# EAGLE schematic Ffrydiau_core (EAGLE 9.6.2)
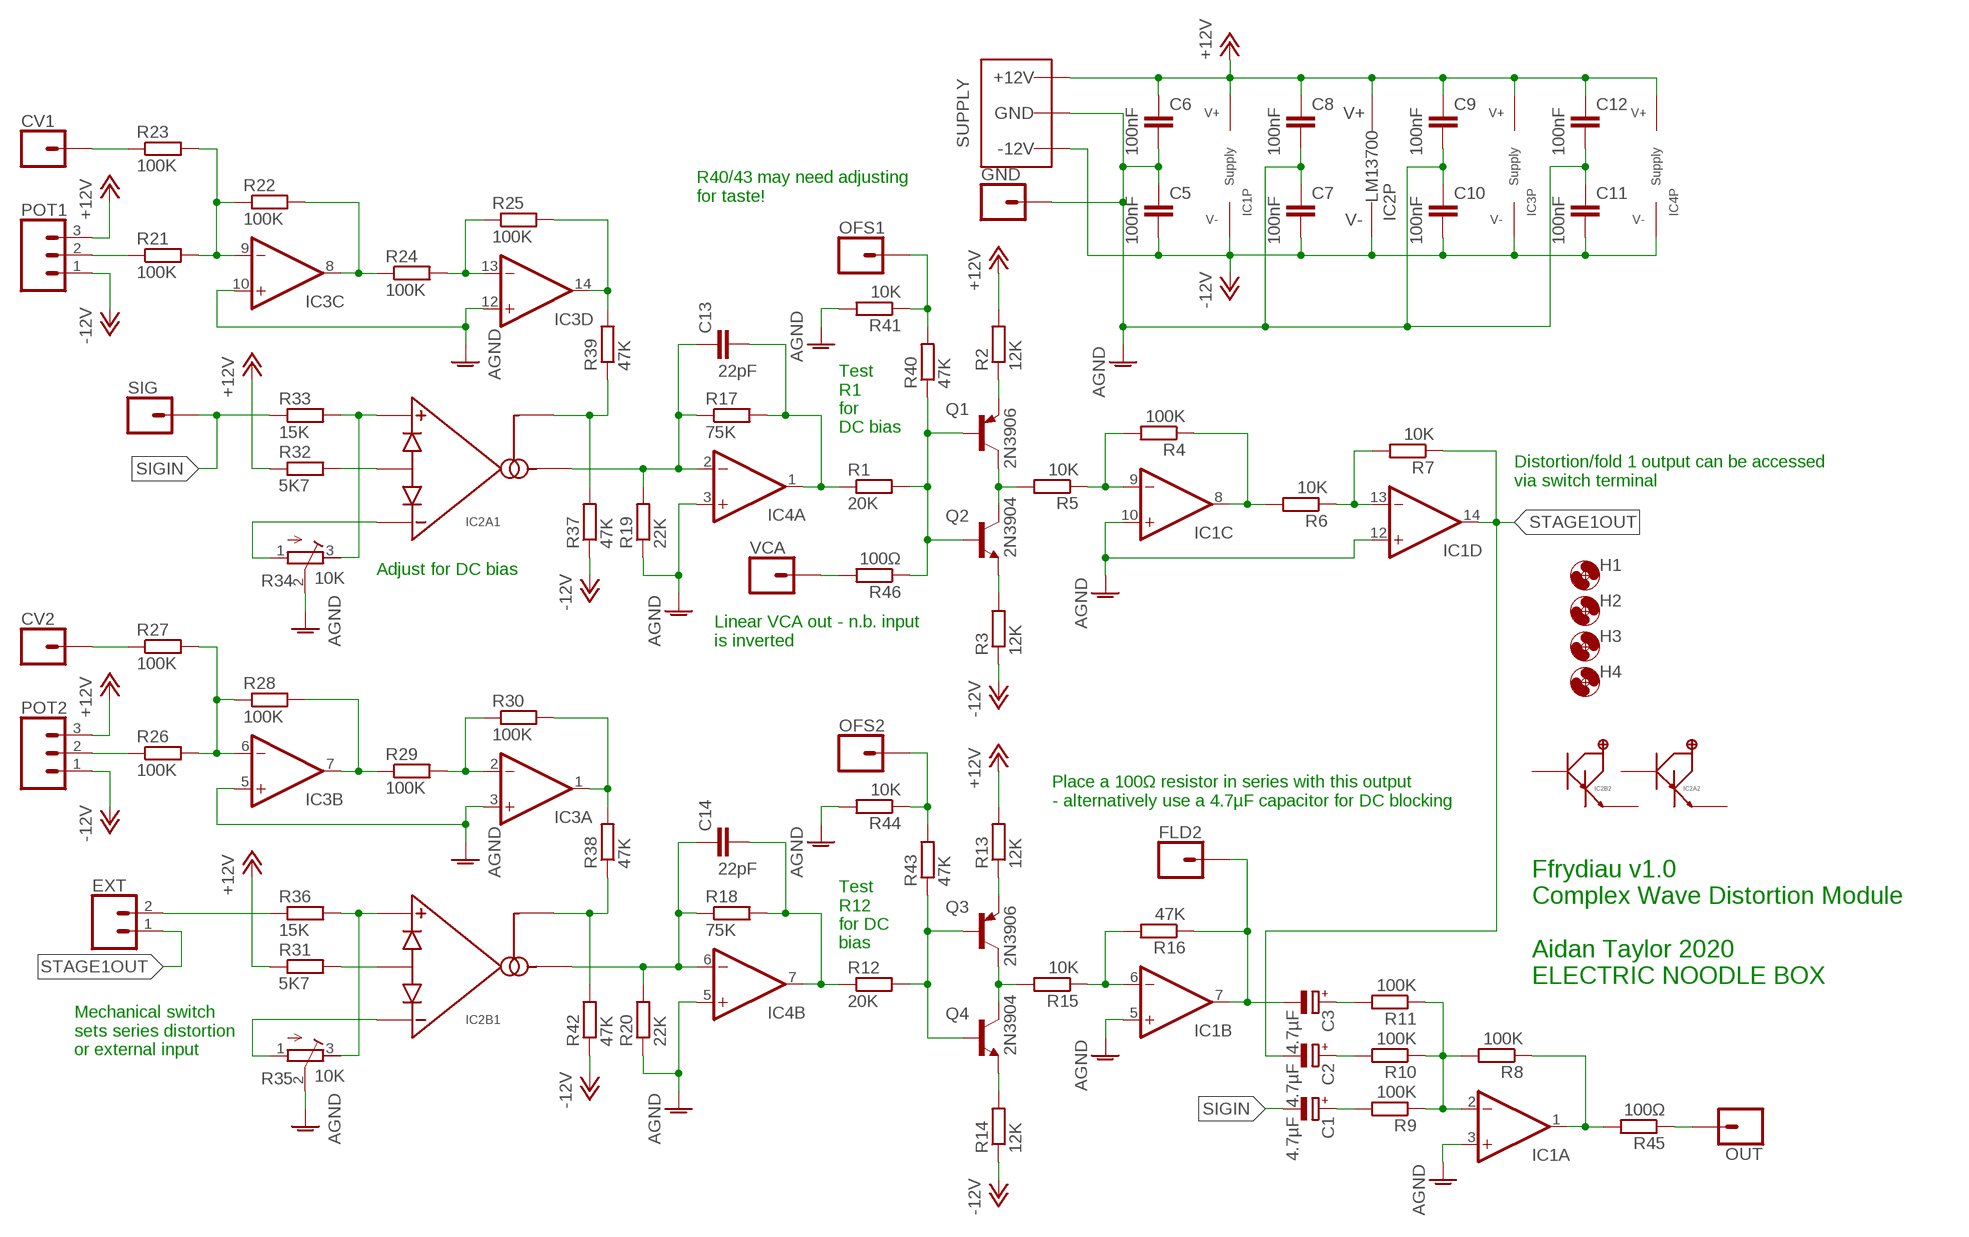
[diagram p0: schematic, sheet 1]

## Parts
C1  4.7µF  CPOL-EUE2,5-6E  [E2,5-6E]
C2  4.7µF  CPOL-EUE2,5-6E  [E2,5-6E]
C3  4.7µF  CPOL-EUE2,5-6E  [E2,5-6E]
C5  100nF  C-EU050-025X075  [C050-025X075]
C6  100nF  C-EU050-025X075  [C050-025X075]
C7  100nF  C-EU050-025X075  [C050-025X075]
C8  100nF  C-EU050-025X075  [C050-025X075]
C9  100nF  C-EU050-025X075  [C050-025X075]
C10  100nF  C-EU050-025X075  [C050-025X075]
C11  100nF  C-EU050-025X075  [C050-025X075]
C12  100nF  C-EU050-025X075  [C050-025X075]
C13  22pF  C-EU050-025X075  [C050-025X075]
C14  22pF  C-EU050-025X075  [C050-025X075]
CV1  1XWIREPAD  [1X01]
CV2  1XWIREPAD  [1X01]
EXT  2XWIREPAD  [1X02]
FLD2  1XWIREPAD  [1X01]
GND  1XWIREPAD  [1X01]
H1  MOUNT-HOLE3.2  [3,2]
H2  MOUNT-HOLE3.2  [3,2]
H3  MOUNT-HOLE3.2  [3,2]
H4  MOUNT-HOLE3.2  [3,2]
IC1  TL0X4DIL  [DIL14]
IC2  LM13700DIL  [DIL16]
IC3  TL0X4DIL  [DIL14]
IC4  TL0X2DIL  [DIL08]
OFS1  1XWIREPAD  [1X01]
OFS2  1XWIREPAD  [1X01]
OUT  1XWIREPAD  [1X01]
POT1  3XWIREPAD  [1X03]
POT2  3XWIREPAD  [1X03]
Q1  2N3906  [TO92]
Q2  2N3904  [TO92]
Q3  2N3906  [TO92]
Q4  2N3904  [TO92]
R1  20K  R-EU_0207/10  [0207/10]
R2  12K  R-EU_0207/10  [0207/10]
R3  12K  R-EU_0207/10  [0207/10]
R4  100K  R-EU_0207/10  [0207/10]
R5  10K  R-EU_0207/10  [0207/10]
R6  10K  R-EU_0207/10  [0207/10]
R7  10K  R-EU_0207/10  [0207/10]
R8  100K  R-EU_0207/10  [0207/10]
R9  100K  R-EU_0207/10  [0207/10]
R10  100K  R-EU_0207/10  [0207/10]
R11  100K  R-EU_0207/10  [0207/10]
R12  20K  R-EU_0207/10  [0207/10]
R13  12K  R-EU_0207/10  [0207/10]
R14  12K  R-EU_0207/10  [0207/10]
R15  10K  R-EU_0207/10  [0207/10]
R16  47K  R-EU_0207/10  [0207/10]
R17  75K  R-EU_0207/10  [0207/10]
R18  75K  R-EU_0207/10  [0207/10]
R19  22K  R-EU_0207/10  [0207/10]
R20  22K  R-EU_0207/10  [0207/10]
R21  100K  R-EU_0207/10  [0207/10]
R22  100K  R-EU_0207/10  [0207/10]
R23  100K  R-EU_0207/10  [0207/10]
R24  100K  R-EU_0207/10  [0207/10]
R25  100K  R-EU_0207/10  [0207/10]
R26  100K  R-EU_0207/10  [0207/10]
R27  100K  R-EU_0207/10  [0207/10]
R28  100K  R-EU_0207/10  [0207/10]
R29  100K  R-EU_0207/10  [0207/10]
R30  100K  R-EU_0207/10  [0207/10]
R31  5K7  R-EU_0207/10  [0207/10]
R32  5K7  R-EU_0207/10  [0207/10]
R33  15K  R-EU_0207/10  [0207/10]
R34  10K  R-TRIMM3296W  [RTRIM3296W]
R35  10K  R-TRIMM3296W  [RTRIM3296W]
R36  15K  R-EU_0207/10  [0207/10]
R37  47K  R-EU_0207/10  [0207/10]
R38  47K  R-EU_0207/10  [0207/10]
R39  47K  R-EU_0207/10  [0207/10]
R40  47K  R-EU_0207/10  [0207/10]
R41  10K  R-EU_0207/10  [0207/10]
R42  47K  R-EU_0207/10  [0207/10]
R43  47K  R-EU_0207/10  [0207/10]
R44  10K  R-EU_0207/10  [0207/10]
R45  100Ω  R-EU_0207/10  [0207/10]
R46  100Ω  R-EU_0207/10  [0207/10]
SIG  1XWIREPAD  [1X01]
VCA  1XWIREPAD  [1X01]
WP1  COMBO_SUPPLY_HEADER  [COMBINED_POWER]

## Nets
+12V: C6.1 C8.1 C9.1 C12.1 IC1.4(P:V+) IC2.11(P:V+) IC3.4(P:V+) IC4.8(P:V+) POT1.3 POT2.3 R2.2 R13.2 R31.1 R32.1 WP1.V+1(V++) WP1.V+2(V++) WP1.V+3(V++)
-12V: C5.2 C7.2 C10.2 C11.2 IC1.11(P:V-) IC2.6(P:V-) IC3.11(P:V-) IC4.4(P:V-) POT1.1 POT2.1 R3.1 R14.1 R37.1 R42.1 WP1.V-1(V--) WP1.V-2(V--) WP1.V-3(V--)
AGND: C5.1 C6.2 C7.1 C8.2 C9.2 C10.1 C11.1 C12.2 GND.1 IC1.3(A:+IN) IC1.5(B:+IN) IC1.10(C:+IN) IC1.12(D:+IN) IC3.3(A:+IN) IC3.5(B:+IN) IC3.10(C:+IN) IC3.12(D:+IN) IC4.3(A:+IN) IC4.5(B:+IN) R19.1 R20.1 R34.2(S) R35.2(S) R41.2 R44.2 WP1.GND1(AGND) WP1.GND2(AGND) WP1.GND3(AGND) WP1.GND4(AGND) WP1.GND5(AGND) WP1.GND6(AGND) WP1.GND7(AGND) WP1.GND8(AGND)
N$1: Q1.2(B) Q2.2(B) R1.2 R40.1 R46.1
N$2: Q1.3(E) R2.1
N$3: Q2.3(E) R3.2
N$4: Q1.1(C) Q2.1(C) R5.2
N$5: IC1.9(C:-IN) R4.2 R5.1
N$6: IC1.8(C:OUT) R4.1 R6.2
N$7: IC1.13(D:-IN) R6.1 R7.2
N$8: OUT.1 R45.1
N$9: C13.2 IC4.1(A:OUT) R1.1 R17.2
N$10: C3.+ R11.2
N$11: C2.+ R10.2
N$12: C1.+ R9.2
N$13: IC1.2(A:-IN) R8.2 R9.1 R10.1 R11.1
N$14: IC1.1(A:OUT) R8.1 R45.2
N$15: Q3.2(B) Q4.2(B) R12.2 R43.1
N$16: Q3.3(E) R13.1
N$17: Q4.3(E) R14.2
N$18: Q3.1(C) Q4.1(C) R15.2
N$19: IC1.6(B:-IN) R15.1 R16.2
N$20: C3.- FLD2.1 IC1.7(B:OUT) R16.1
N$21: C14.1 IC2.12(B1:AMPOUT) IC4.6(B:-IN) R18.1 R20.2
N$22: C13.1 IC2.5(A1:AMPOUT) IC4.2(A:-IN) R17.1 R19.2
N$23: C14.2 IC4.7(B:OUT) R12.1 R18.2
N$24: IC3.9(C:-IN) R21.2 R22.1 R23.2
N$25: IC3.8(C:OUT) R22.2 R24.1
N$26: IC3.13(D:-IN) R24.2 R25.1
N$27: IC3.14(D:OUT) R25.2 R39.2
N$28: CV2.1 R27.1
N$29: IC3.1(A:OUT) R30.2 R38.2
N$30: POT1.2 R21.1
N$31: IC3.2(A:-IN) R29.2 R30.1
N$32: CV1.1 R23.1
N$33: IC3.7(B:OUT) R28.2 R29.1
N$34: IC3.6(B:-IN) R26.2 R27.2 R28.1
N$35: IC2.14(B1:AMP+) R35.3(E) R36.2
N$36: IC2.13(B1:AMP-) R35.1(A)
N$37: IC2.15(B1:DIODES) R31.2
N$38: IC2.2(A1:DIODES) R32.2
N$39: IC2.1(A1:AMPBIAS) R37.2 R39.1
N$40: POT2.2 R26.1
N$41: IC2.3(A1:AMP+) R33.2 R34.3(E)
N$42: IC2.4(A1:AMP-) R34.1(A)
N$43: IC2.16(B1:AMPBIAS) R38.1 R42.2
N$44: OFS1.1 R40.2 R41.1
N$45: OFS2.1 R43.2 R44.1
N$46: R46.2 VCA.1
N$47: EXT.2 R36.1
SIGIN: C1.- R33.1 SIG.1
STAGE1OUT: C2.- EXT.1 IC1.14(D:OUT) R7.1
Unconnected: IC2.7(A2:BUFF_IN) IC2.8(A2:BUFF_OUT) IC2.9(B2:BUFF_OUT) IC2.10(B2:BUFF_IN)

## Notes on the sheet
- R40/43 may need adjusting 
  for taste!
- Test
  R1
  for
  DC bias
- Distortion/fold 1 output can be accessed
  via switch terminal
- Adjust for DC bias
- Linear VCA out - n.b. input
  is inverted
- Place a 100Ω resistor in series with this output
  - alternatively use a 4.7µF capacitor for DC blocking
- Test
  R12
  for DC
  bias
- Ffrydiau v1.0
  Complex Wave Distortion Module
  
  Aidan Taylor 2020 
  ELECTRIC NOODLE BOX
- Mechanical switch
  sets series distortion
  or external input

## Library data of the parts
C1-C3 = rcl:CPOL-EU: POLARIZED CAPACITOR, European symbol; SPICEPREFIX: C
C5-C14 = rcl:C-EU: CAPACITOR, European symbol; SPICEPREFIX: C
CV1 CV2 FLD2 GND OFS1 OFS2 OUT SIG VCA = ElectricNoodleBox:1XWIREPAD
EXT = ElectricNoodleBox:2XWIREPAD
H1-H4 = holes:MOUNT-HOLE: MOUNTING HOLE with drill center marker
IC1 IC3 = ElectricNoodleBox:TL0X4: Quad Operational Amplifier; CATALOGUE: 3005140; RETAILER: Farnell
IC2 = ElectricNoodleBox:LM13700: Dual Transconductance Amplifier with Darlington Buffer; CATALOGUE: 3118206; RETAILER: Farnell
IC4 = ElectricNoodleBox:TL0X2: Dual Operational Amplifier; CATALOGUE: 1103189; RETAILER: Farnell
POT1 POT2 = ElectricNoodleBox:3XWIREPAD
Q1 Q3 = transistor-pnp:2N3906: PNP Transistor
Q2 Q4 = transistor-npn:2N3904: NPN Transistor
R1-R33 R36-R46 = rcl:R-EU_: RESISTOR, European symbol; SPICEPREFIX: R
R34 R35 = rcl:R-TRIMM: Trimm resistor; SPICEMODEL: X; SPICEPREFIXL: POT
WP1 = ElectricNoodleBox:COMBO_SUPPLY_HEADER